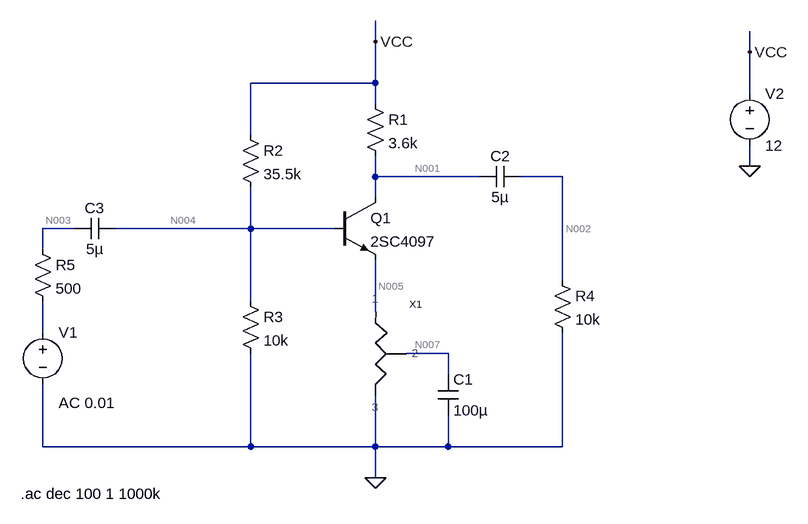
[diagram p0: schematic 2_20.asc]
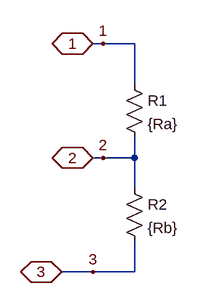
[diagram p1: sub-circuit dian_wei_qi.asc]
2_20.asc, the LTspice schematic file:
Version 4
SHEET 1 880 680
WIRE 224 -160 224 -192
WIRE 800 -144 800 -176
WIRE 224 -96 224 -160
WIRE 224 -96 32 -96
WIRE 800 -80 800 -144
WIRE 224 -64 224 -96
WIRE 32 -16 32 -96
WIRE 800 32 800 0
WIRE 224 48 224 16
WIRE 384 48 224 48
WIRE 512 48 448 48
WIRE 224 80 224 48
WIRE -240 128 -288 128
WIRE 32 128 32 64
WIRE 32 128 -176 128
WIRE 160 128 32 128
WIRE -288 160 -288 128
WIRE 512 208 512 48
WIRE 32 240 32 128
WIRE 224 256 224 176
WIRE -288 288 -288 240
WIRE 336 320 272 320
WIRE 336 352 336 320
WIRE -288 464 -288 368
WIRE 32 464 32 320
WIRE 32 464 -288 464
WIRE 224 464 224 384
WIRE 224 464 32 464
WIRE 336 464 336 416
WIRE 336 464 224 464
WIRE 512 464 512 288
WIRE 512 464 336 464
WIRE 224 512 224 464
FLAG 224 512 0
FLAG 800 32 0
FLAG 224 -160 VCC
FLAG 800 -144 VCC
SYMBOL npn 160 80 R0
SYMATTR InstName Q1
SYMATTR Value 2SC4097
SYMBOL res 208 -80 R0
SYMATTR InstName R1
SYMATTR Value 3.6k
SYMBOL res 16 -32 R0
SYMATTR InstName R2
SYMATTR Value 35.5k
SYMBOL res 16 224 R0
SYMATTR InstName R3
SYMATTR Value 10k
SYMBOL dian_wei_qi 208 320 R0
SYMATTR InstName X1
SYMATTR SpiceLine Ra=100,Rb=753
SYMBOL cap 320 352 R0
SYMATTR InstName C1
SYMATTR Value 100µ
SYMBOL res 496 192 R0
SYMATTR InstName R4
SYMATTR Value 10k
SYMBOL cap 448 32 R90
WINDOW 0 0 32 VBottom 2
WINDOW 3 32 32 VTop 2
SYMATTR InstName C2
SYMATTR Value 5µ
SYMBOL cap -176 112 R90
WINDOW 0 0 32 VBottom 2
WINDOW 3 32 32 VTop 2
SYMATTR InstName C3
SYMATTR Value 5µ
SYMBOL res -304 144 R0
SYMATTR InstName R5
SYMATTR Value 500
SYMBOL voltage -288 272 R0
WINDOW 123 24 124 Left 2
WINDOW 39 0 0 Left 0
SYMATTR InstName V1
SYMATTR Value ""
SYMATTR Value2 AC 0.01
SYMBOL voltage 800 -96 R0
WINDOW 123 0 0 Left 0
WINDOW 39 0 0 Left 0
SYMATTR InstName V2
SYMATTR Value 12
TEXT -322 536 Left 2 !.ac dec 100 1 1000k

dian_wei_qi.asc, the sub-circuit schematic file:
Version 4
SHEET 1 880 680
WIRE 144 -32 128 -32
WIRE 192 -32 144 -32
WIRE 192 32 192 -32
WIRE 144 144 128 144
WIRE 192 144 192 112
WIRE 192 144 144 144
WIRE 192 192 192 144
WIRE 128 320 80 320
WIRE 192 320 192 272
WIRE 192 320 128 320
FLAG 144 -32 1
FLAG 144 144 2
FLAG 128 320 3
FLAG 128 -32 1
IOPIN 128 -32 BiDir
FLAG 128 144 2
IOPIN 128 144 BiDir
FLAG 80 320 3
IOPIN 80 320 BiDir
SYMBOL res 176 16 R0
SYMATTR InstName R1
SYMATTR Value {Ra}
SYMBOL res 176 176 R0
SYMATTR InstName R2
SYMATTR Value {Rb}

The netlist it stands for:
* 2_20.asc
Q1 N001 N004 N005 0 2SC4097
R1 VCC N001 3.6k
R2 VCC N004 35.5k
R3 N004 0 10k
XX1 N005 N007 0 dian_wei_qi params: Ra=100,Rb=753
C1 N007 0 100µ
R4 N002 0 10k
C2 N002 N001 5µ
C3 N004 N003 5µ
R5 N003 N006 500
V1 N006 0 AC 0.01
V2 VCC 0 12

* block symbol definitions
.subckt dian_wei_qi 1 2 3
R1 1 2 {Ra}
R2 2 3 {Rb}
.ends dian_wei_qi

.model NPN NPN
.model PNP PNP
.lib standard.bjt
.ac dec 100 1 1000k
.backanno
.end

* Results of the author's LTspice run, read from the files saved beside the schematic
* Operating Point, zero values left out:
*   V(n001) = 3.503 V
*   V(n004) = 2.54 V
*   V(n005) = 2.024 V
*   V(vcc) = 12 V
*   V(n007) = 1.787 V
*   Ic(Q1) = 2.36 mA
*   Ib(Q1) = 12.46 µA
*   Ie(Q1) = -2.373 mA
*   I(R3) = 254 µA
*   I(R2) = 266.5 µA
*   I(R1) = 2.36 mA
*   I(V2) = -2.627 mA
*   Ix(x1:1) = 2.373 mA
*   Ix(x1:3) = -2.373 mA
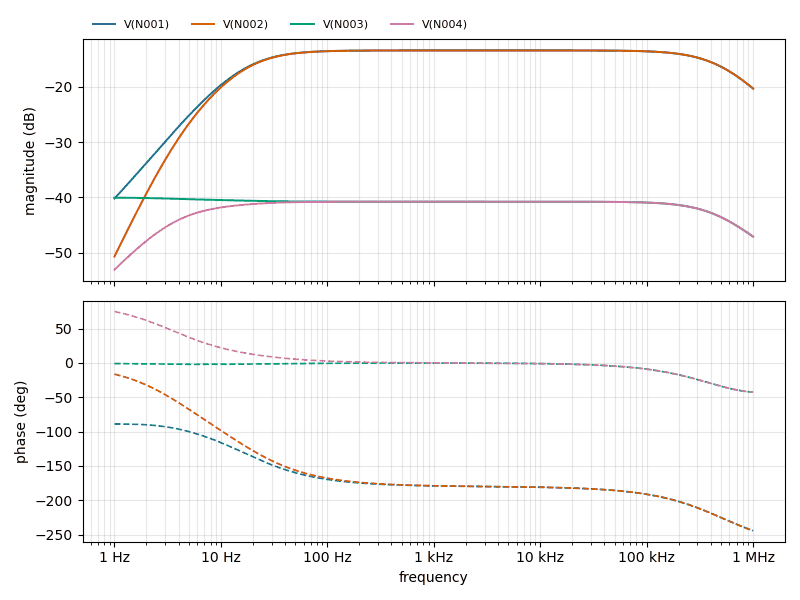
[diagram p2: AC Analysis of 2_20.asc, plotted from the saved traces]
* AC Analysis, 1 run:
*   V(N001): -40.20 dB at 1 Hz, -20.33 dB at 1 MHz, peak -13.45 dB at 3.02 kHz, 3 dB below the peak at 17.72 Hz and 507.9 kHz
*   V(N002): -50.66 dB at 1 Hz, -20.33 dB at 1 MHz, peak -13.45 dB at 3.02 kHz, 3 dB below the peak at 18.26 Hz and 507.9 kHz
*   V(N003): -40.03 dB at 1 Hz, -47.06 dB at 1 MHz, peak -40.03 dB at 1 Hz, 3 dB below the peak at 436.1 kHz
*   V(N004): -53.04 dB at 1 Hz, -47.06 dB at 1 MHz, peak -40.76 dB at 1.995 kHz, 3 dB below the peak at 4.3 Hz and 527.5 kHz